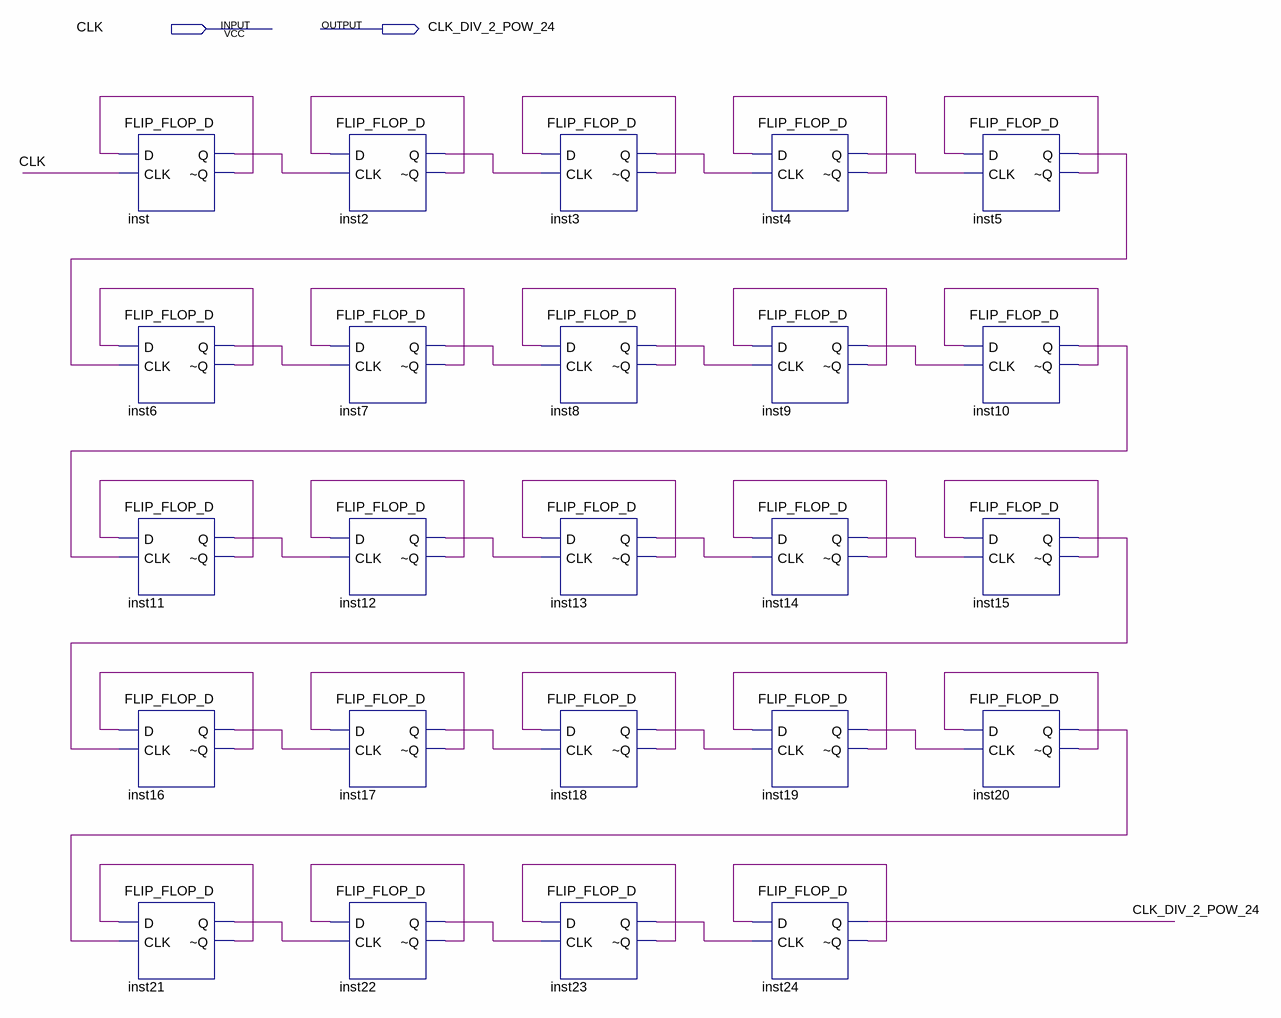
[diagram p0: schematic sheet]
// Quartus schematic FREQUENCY_DIVIDER_OLD.bdf as structural Verilog: 24 symbols, 2 pins
module FREQUENCY_DIVIDER_OLD (
  input  CLK,
  output CLK_DIV_2_POW_24
);

  wire inst2__q, inst2_q, inst3__q, inst3_q, inst4__q, inst4_q, inst5__q, inst5_q, inst6__q, inst6_q,
       inst7__q, inst7_q, inst8__q, inst8_q, inst9__q, inst9_q, inst10__q, inst10_q, inst11__q, inst11_q,
       inst12__q, inst12_q, inst13__q, inst13_q, inst14__q, inst14_q, inst15__q, inst15_q, inst16__q,
       inst16_q, inst17__q, inst17_q, inst18__q, inst18_q, inst19__q, inst19_q, inst20__q, inst20_q,
       inst21__q, inst21_q, inst22__q, inst22_q, inst23__q, inst23_q, inst24__q, inst__q, inst_q;

  FLIP_FLOP_D inst (.D(inst__q), .CLK(CLK), .Q(inst_q), .\~Q (inst__q));
  FLIP_FLOP_D inst6 (.D(inst6__q), .CLK(inst5_q), .Q(inst6_q), .\~Q (inst6__q));
  FLIP_FLOP_D inst11 (.D(inst11__q), .CLK(inst10_q), .Q(inst11_q), .\~Q (inst11__q));
  FLIP_FLOP_D inst16 (.D(inst16__q), .CLK(inst15_q), .Q(inst16_q), .\~Q (inst16__q));
  FLIP_FLOP_D inst21 (.D(inst21__q), .CLK(inst20_q), .Q(inst21_q), .\~Q (inst21__q));
  FLIP_FLOP_D inst2 (.D(inst2__q), .CLK(inst_q), .Q(inst2_q), .\~Q (inst2__q));
  FLIP_FLOP_D inst7 (.D(inst7__q), .CLK(inst6_q), .Q(inst7_q), .\~Q (inst7__q));
  FLIP_FLOP_D inst12 (.D(inst12__q), .CLK(inst11_q), .Q(inst12_q), .\~Q (inst12__q));
  FLIP_FLOP_D inst17 (.D(inst17__q), .CLK(inst16_q), .Q(inst17_q), .\~Q (inst17__q));
  FLIP_FLOP_D inst22 (.D(inst22__q), .CLK(inst21_q), .Q(inst22_q), .\~Q (inst22__q));
  FLIP_FLOP_D inst3 (.D(inst3__q), .CLK(inst2_q), .Q(inst3_q), .\~Q (inst3__q));
  FLIP_FLOP_D inst8 (.D(inst8__q), .CLK(inst7_q), .Q(inst8_q), .\~Q (inst8__q));
  FLIP_FLOP_D inst13 (.D(inst13__q), .CLK(inst12_q), .Q(inst13_q), .\~Q (inst13__q));
  FLIP_FLOP_D inst18 (.D(inst18__q), .CLK(inst17_q), .Q(inst18_q), .\~Q (inst18__q));
  FLIP_FLOP_D inst23 (.D(inst23__q), .CLK(inst22_q), .Q(inst23_q), .\~Q (inst23__q));
  FLIP_FLOP_D inst4 (.D(inst4__q), .CLK(inst3_q), .Q(inst4_q), .\~Q (inst4__q));
  FLIP_FLOP_D inst9 (.D(inst9__q), .CLK(inst8_q), .Q(inst9_q), .\~Q (inst9__q));
  FLIP_FLOP_D inst14 (.D(inst14__q), .CLK(inst13_q), .Q(inst14_q), .\~Q (inst14__q));
  FLIP_FLOP_D inst19 (.D(inst19__q), .CLK(inst18_q), .Q(inst19_q), .\~Q (inst19__q));
  FLIP_FLOP_D inst24 (.D(inst24__q), .CLK(inst23_q), .Q(CLK_DIV_2_POW_24), .\~Q (inst24__q));
  FLIP_FLOP_D inst5 (.D(inst5__q), .CLK(inst4_q), .Q(inst5_q), .\~Q (inst5__q));
  FLIP_FLOP_D inst10 (.D(inst10__q), .CLK(inst9_q), .Q(inst10_q), .\~Q (inst10__q));
  FLIP_FLOP_D inst15 (.D(inst15__q), .CLK(inst14_q), .Q(inst15_q), .\~Q (inst15__q));
  FLIP_FLOP_D inst20 (.D(inst20__q), .CLK(inst19_q), .Q(inst20_q), .\~Q (inst20__q));
endmodule
